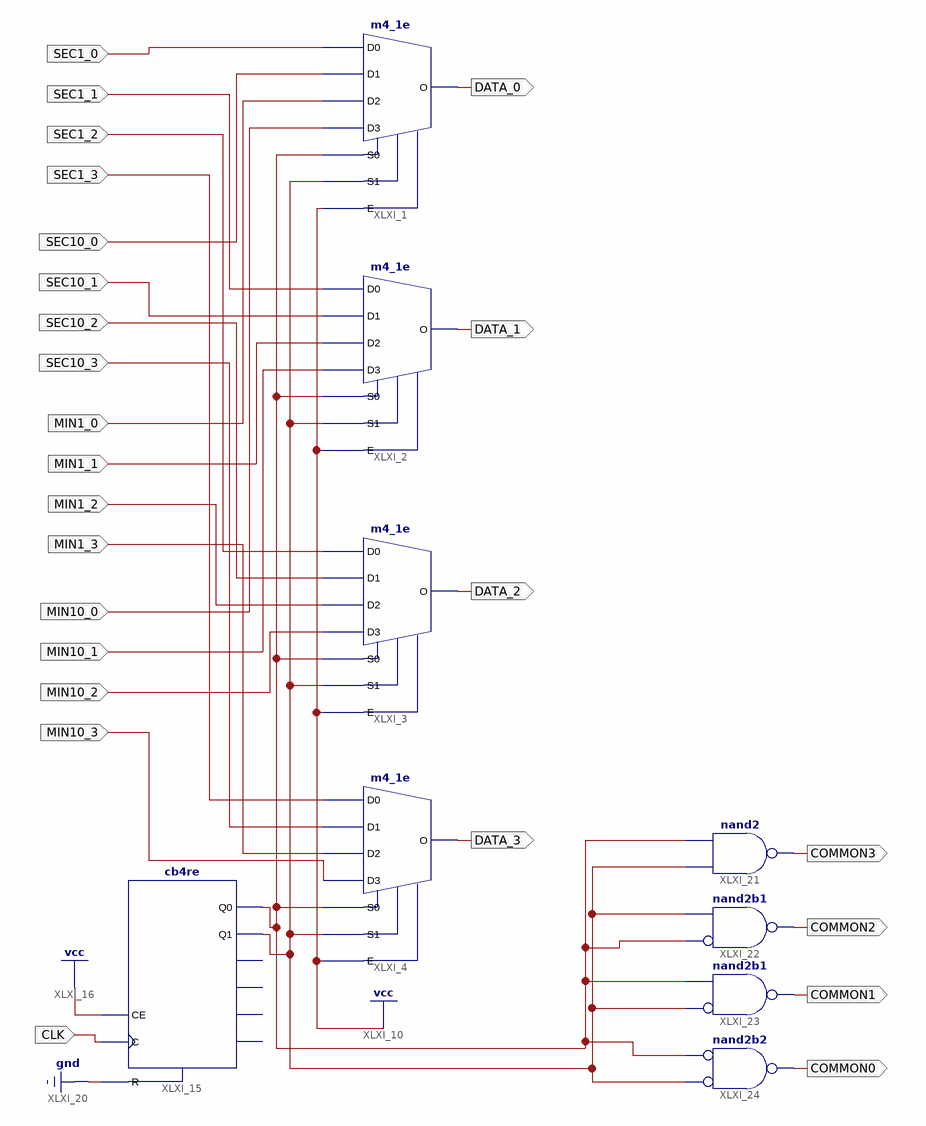
[diagram p0: schematic sheet 1]
// Xilinx ISE schematic MULTIPLEXER.sch (spartan6) as structural Verilog: 9 symbols, 25 ports
module MULTIPLEXER (
  input  SEC1_0,
  input  SEC1_1,
  input  SEC1_2,
  input  SEC1_3,
  input  SEC10_0,
  input  SEC10_1,
  input  SEC10_2,
  input  SEC10_3,
  input  MIN1_0,
  input  MIN1_1,
  input  MIN1_2,
  input  MIN1_3,
  input  MIN10_0,
  input  MIN10_1,
  input  MIN10_2,
  input  MIN10_3,
  input  CLK,
  output DATA_0,
  output DATA_1,
  output DATA_2,
  output DATA_3,
  output COMMON0,
  output COMMON1,
  output COMMON2,
  output COMMON3
);

  wire XLXN_27, XLXN_28;

  m4_1e XLXI_1 (.D0(SEC1_0), .D1(SEC10_0), .D2(MIN1_0), .D3(MIN10_0), .E(1'b1), .S0(XLXN_27), .S1(XLXN_28), .O(DATA_0));
  m4_1e XLXI_2 (.D0(SEC1_1), .D1(SEC10_1), .D2(MIN1_1), .D3(MIN10_1), .E(1'b1), .S0(XLXN_27), .S1(XLXN_28), .O(DATA_1));
  m4_1e XLXI_3 (.D0(SEC1_2), .D1(SEC10_2), .D2(MIN1_2), .D3(MIN10_2), .E(1'b1), .S0(XLXN_27), .S1(XLXN_28), .O(DATA_2));
  m4_1e XLXI_4 (.D0(SEC1_3), .D1(SEC10_3), .D2(MIN1_3), .D3(MIN10_3), .E(1'b1), .S0(XLXN_27), .S1(XLXN_28), .O(DATA_3));
  cb4re XLXI_15 (.C(CLK), .CE(1'b1), .R(1'b0), .Q0(XLXN_27), .Q1(XLXN_28));  // open: CEO, Q2, Q3, TC
  nand XLXI_21 (COMMON3, XLXN_28, XLXN_27);
  nand XLXI_22 (COMMON2, ~XLXN_27, XLXN_28);  // nand2b1
  nand XLXI_23 (COMMON1, ~XLXN_28, XLXN_27);  // nand2b1
  nand XLXI_24 (COMMON0, ~XLXN_28, ~XLXN_27);  // nand2b2
endmodule
